# Altium schematic sheet Sheet1.SchDoc
size A4
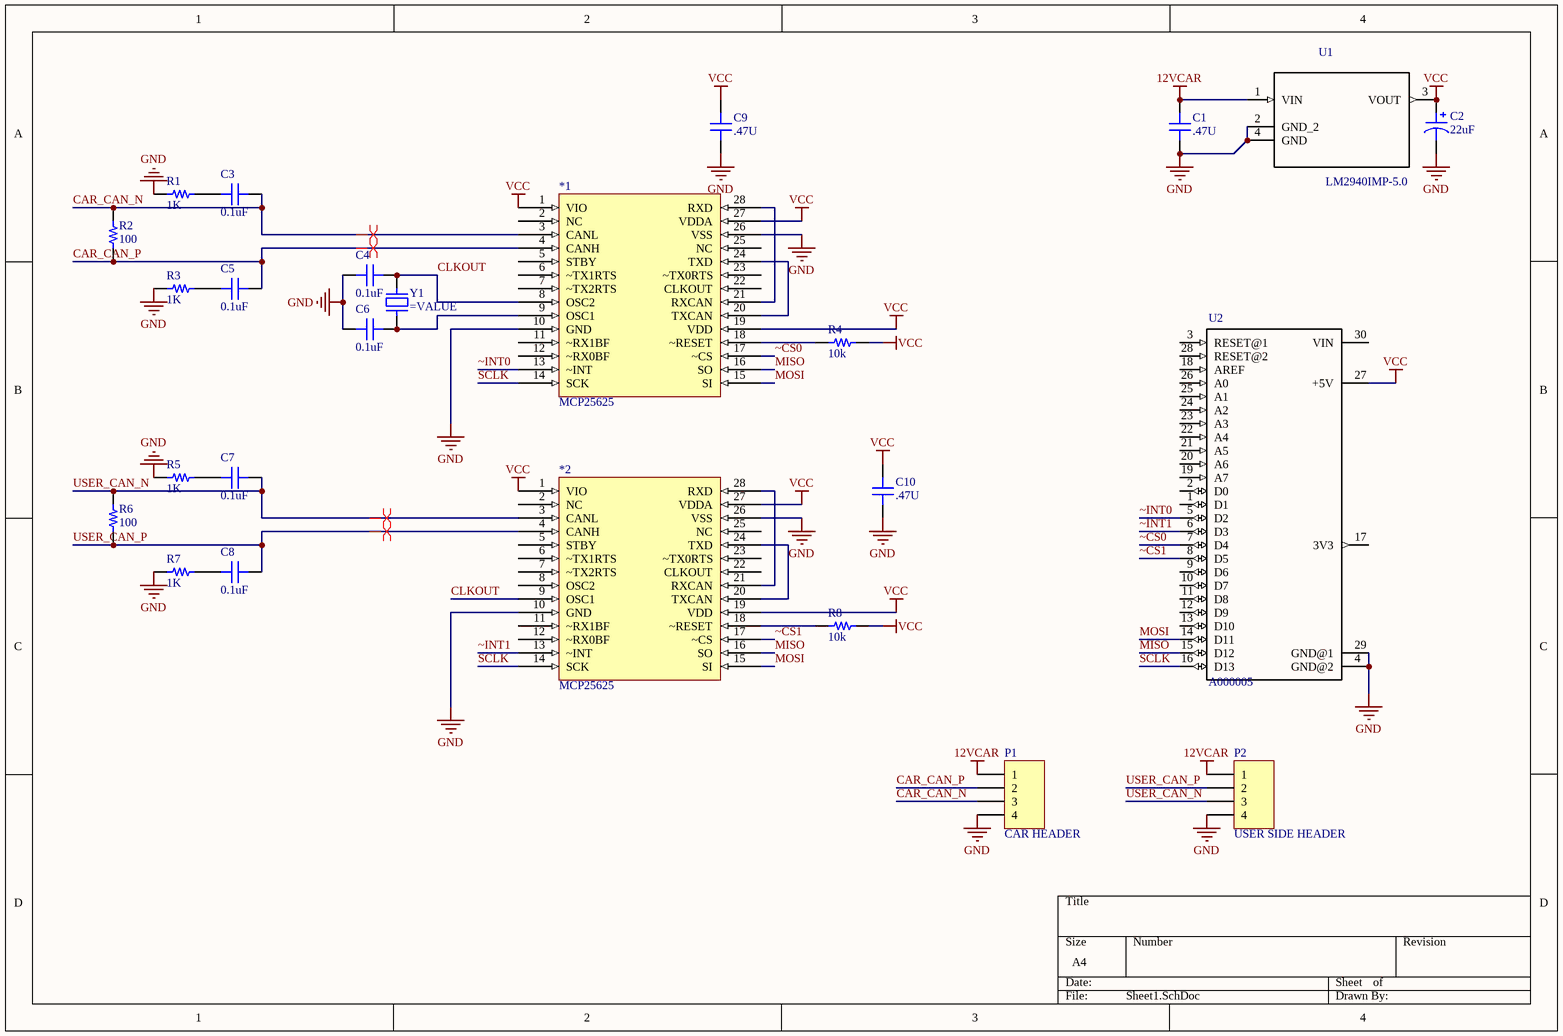
[diagram p0: Sheet1.SchDoc]

## Parts
*1  MCP25625  [SOP65P780X200-28L]
*2  MCP25625  [SOP65P780X200-28L]
C1  .47U  [CAP 0805/2012]
C2  22uF  [CAP POL 2917/7343]
C3  0.1uF  [CAP 0805/2012]
C4  0.1uF  [CAP 0805/2012]
C5  0.1uF  [CAP 0805/2012]
C6  0.1uF  [CAP 0805/2012]
C7  0.1uF  [CAP 0805/2012]
C8  0.1uF  [CAP 0805/2012]
C9  .47U  [CAP 0805/2012]
C10  .47U  [CAP 0805/2012]
P1  CAR HEADER  [HDR1X4]
P2  USER SIDE HEADER  [HDR1X4]
R1  1K  [RES 0805/2012]
R2  100  [RES 0805/2012]
R3  1K  [RES 0805/2012]
R4  10k  [RES 0805/2012]
R5  1K  [RES 0805/2012]
R6  100  [RES 0805/2012]
R7  1K  [RES 0805/2012]
R8  10k  [RES 0805/2012]
U1  LM2940IMP-5.0  [SOT230P696X180-4N]
U2  A000005  [ARDUINO_A000005]
Y1  (no value)  [XTAL_HC49P488W45L1150T500H350]

## Nets
12VCAR: C1.2 P1.1 P2.1 U1.1(VIN)
GND: *1.10(GND) *1.26(VSS) *2.10(GND) *2.26(VSS) C1.1 C2.2 C4.1 C6.1 C9.1 C10.1 P1.4 P2.4 R1.1 R3.1 R5.1 R7.1 U1.2(GND_2) U1.4(GND) U2.4(GND@2) U2.29(GND@1)
VCC: *1.1(VIO) *1.19(VDD) *1.27(VDDA) *2.1(VIO) *2.19(VDD) *2.27(VDDA) C2.1 C9.2 C10.2 R4.2 R8.2 U1.3(VOUT) U2.27(+5V)
CAR_CAN_N: *1.3(CANL) C3.1 P1.3 R2.2
CAR_CAN_P: *1.4(CANH) C5.1 P1.2 R2.1
CLKOUT: *1.8(OSC2) *2.9(OSC1) C4.2 Y1.2
MISO: *1.16(SO) *2.16(SO) U2.15(D12)
MOSI: *1.15(SI) *2.15(SI) U2.14(D11)
SCLK: *1.14(SCK) *2.14(SCK) U2.16(D13)
USER_CAN_N: *2.3(CANL) C7.1 P2.3 R6.2
USER_CAN_P: *2.4(CANH) C8.1 P2.2 R6.1
~CS0: *1.17(~CS) U2.7(D4)
~CS1: *2.17(~CS) U2.8(D5)
~INT0: *1.13(~INT) U2.5(D2)
~INT1: *2.13(~INT) U2.6(D3)
Net*1_9: *1.9(OSC1) C6.2 Y1.1
Net*1_18: *1.18(~RESET) R4.1
Net*1_20: *1.20(TXCAN) *1.24(TXD)
Net*1_21: *1.21(RXCAN) *1.28(RXD)
Net*2_18: *2.18(~RESET) R8.1
Net*2_20: *2.20(TXCAN) *2.24(TXD)
Net*2_21: *2.21(RXCAN) *2.28(RXD)
NetC3_2: C3.2 R1.2
NetC5_2: C5.2 R3.2
NetC7_2: C7.2 R5.2
NetC8_2: C8.2 R7.2

Not connected (* = marked no-connect by the designer): *1 2(NC) 5(STBY) 6(~TX1RTS) 7(~TX2RTS) 11(~RX1BF) 12(~RX0BF) 22(CLKOUT) 23(~TX0RTS) 25(NC); *2 2(NC) 5(STBY) 6(~TX1RTS) 7(~TX2RTS) 8(OSC2) 11(~RX1BF) 12(~RX0BF) 22(CLKOUT) 23(~TX0RTS) 25(NC); U2 1(D1) 2(D0) 3(RESET@1) 9(D6) 10(D7) 11(D8) 12(D9) 13(D10) 17(3V3) 18(AREF) 19(A7) 20(A6) 21(A5) 22(A4) 23(A3) 24(A2) 25(A1) 26(A0) 28(RESET@2) 30(VIN)

## Layout directives
differential pair: CAR_CAN_N, CAR_CAN_P, USER_CAN_N, USER_CAN_P

## Library data of the parts
C1 C3-C10 = Capacitor: SMT Capacitor
  C1 C9 C10: Value: .47U
  C3-C8: Value: 0.1uF
C2 = Polarised Capacitor: SMT Polarised Capacitor; Value: 22uF
P1 P2 = Header 4: Header, 4-Pin; LatestRevisionDate: 17-Jul-2002; LatestRevisionNote: Re-released for DXP Platform.; Publisher: Altium Limited
R1-R8 = Resistor: SMT Resistor
  R1 R3 R5 R7: Value: 1K
  R2 R6: Value: 100
  R4 R8: Value: 10k
U1 = LM2940IMP-5.0: IC REG LINEAR 5V 1A SOT223-4; MF: Texas Instruments; MP: LM2940IMP-5.0/NOPB; Availability: Good; Package: SOT-223-4 Texas Instruments; Price: 1.44 USD; Value: *
U2 = A000005: ARDUINO NANO BOARD; MP: A000005; Digi-Key_Purchase_URL: https://www.digikey.ca/product-detail/en/arduino/A000005/1050-1001-ND/2638989?WT.z_cid=ref_snapeda&utm_source=snapeda&utm_medium=aggregator&utm_campaign=buynow; Package: None; MF: Arduino; Digi-Key_Part_Number: 1050-1001-ND; Value: *
Y1 = Abracon Crystal ABS07: SMT Crystal